# Altium schematic sheet 02-ChargeControl.SchDoc
size A3
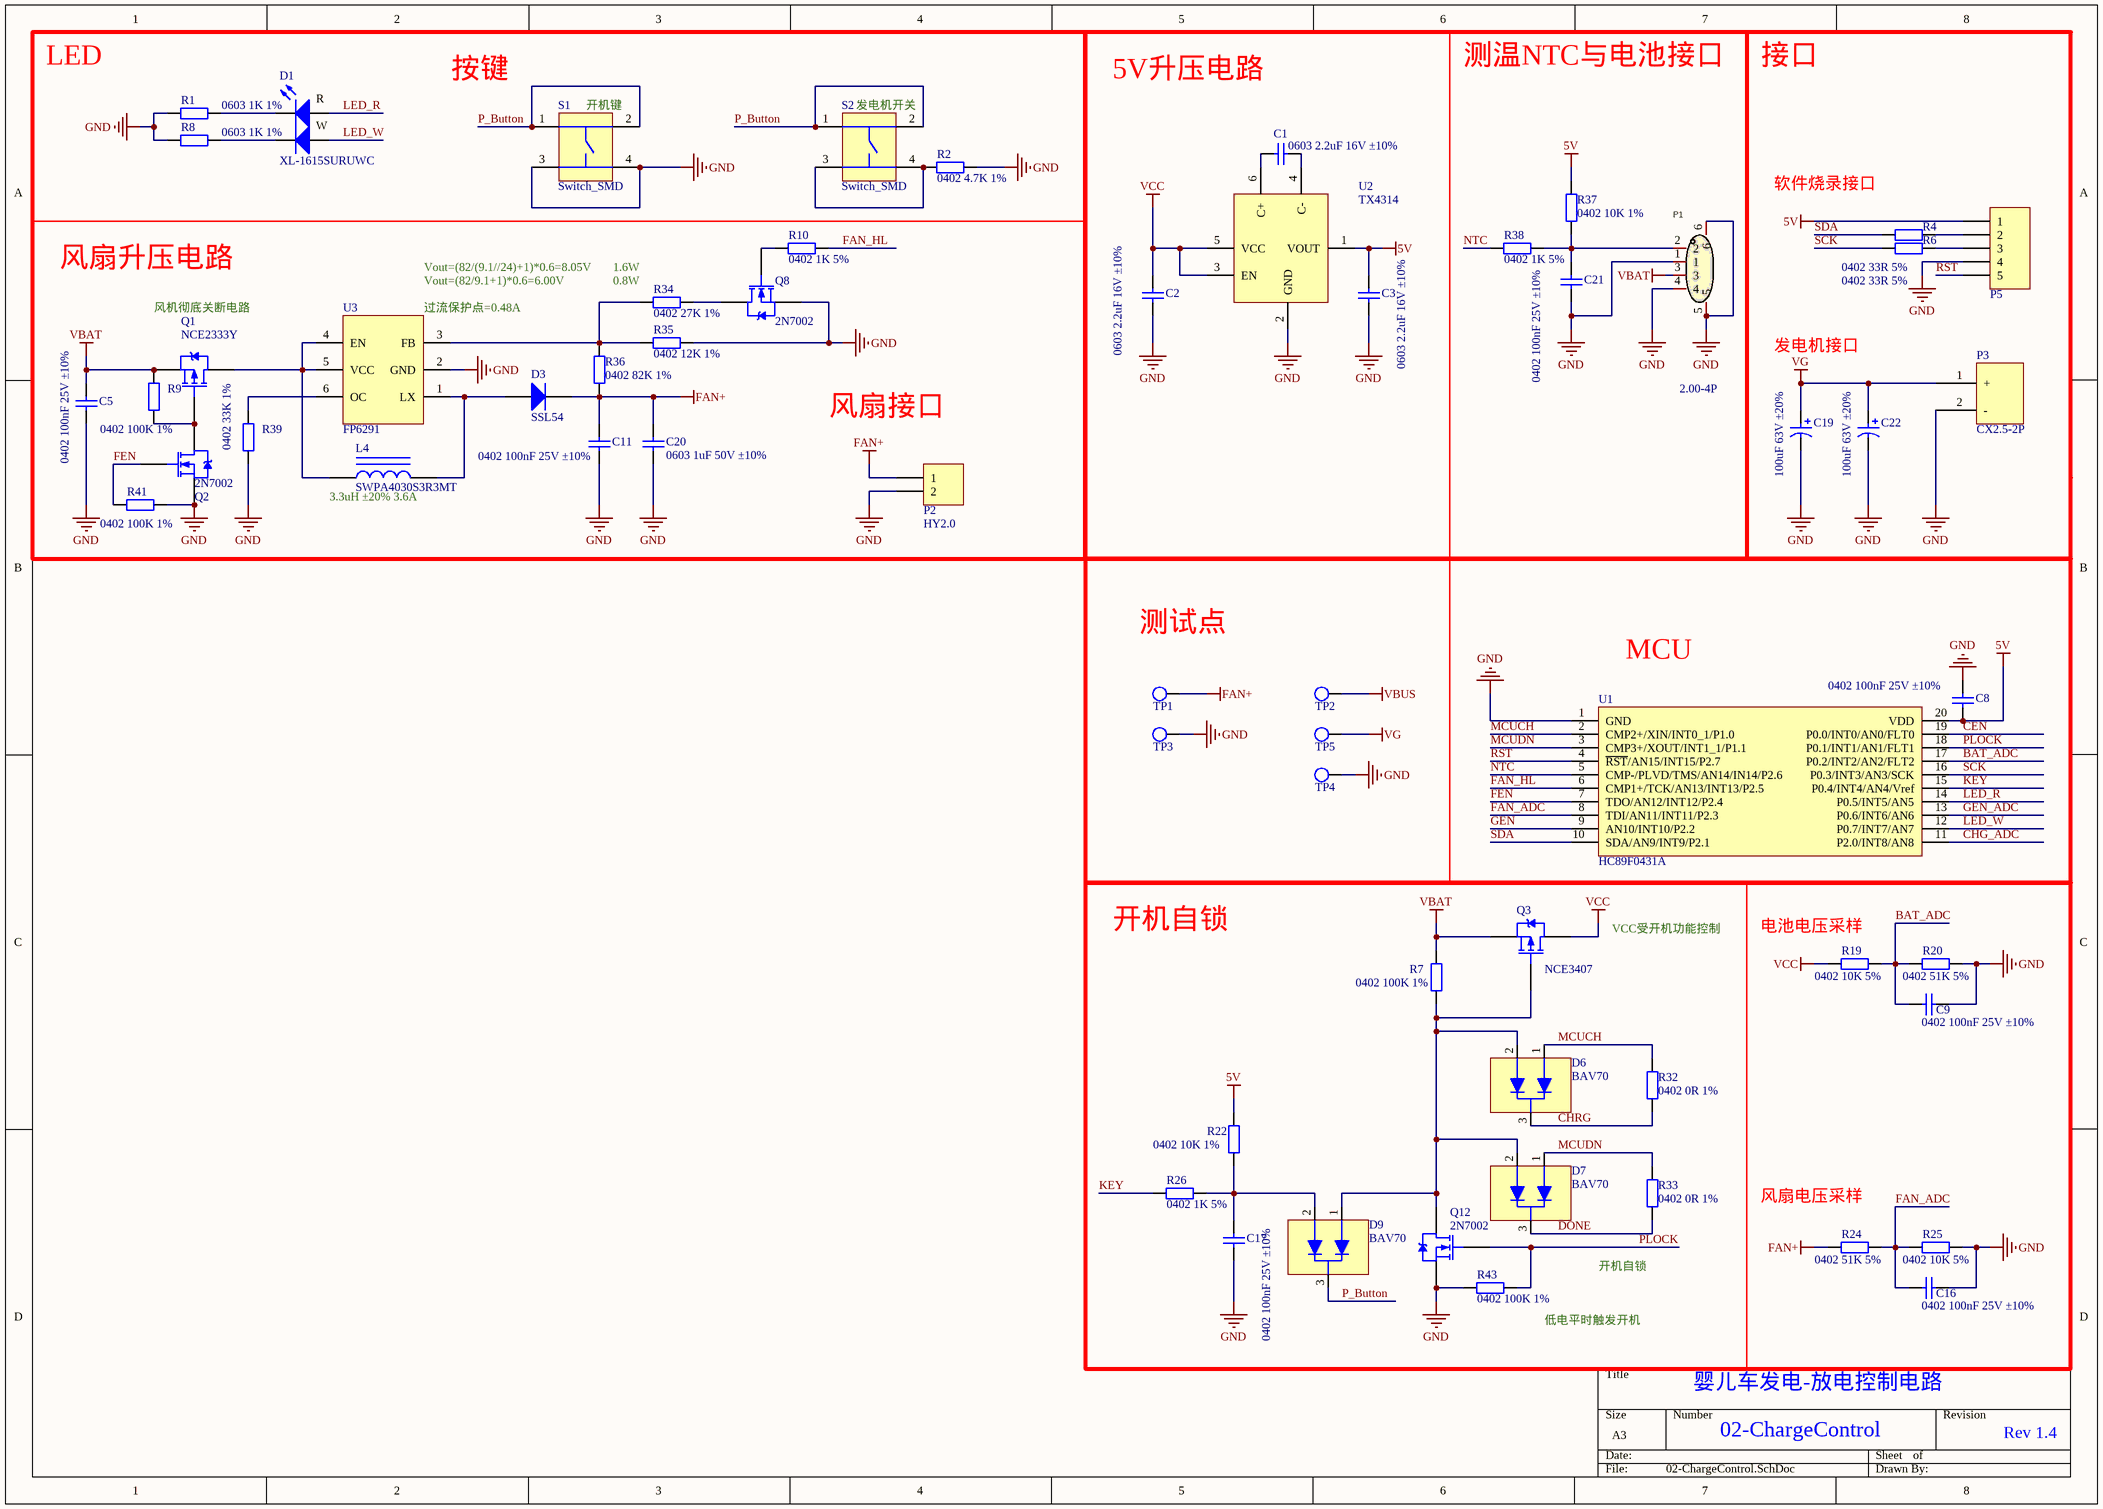
[diagram p0: 02-ChargeControl.SchDoc]

## Parts
C1  0603 2.2uF 16V ±10%  [C0603]
C2  0603 2.2uF 16V ±10%  [C0603]
C3  0603 2.2uF 16V ±10%  [C0603]
C5  0402 100nF 25V ±10%  [C0402]
C8  0402 100nF 25V ±10%  [C0402]
C9  0402 100nF 25V ±10%  [C0402]
C11  0402 100nF 25V ±10%  [C0402]
C16  0402 100nF 25V ±10%  [C0402]
C17  0402 100nF 25V ±10%  [C0402]
C19  100uF 63V ±20%  [CAP-TH_BD8-P3.50-D1.0-WD]
C20  0603 1uF 50V ±10%  [C0603]
C21  0402 100nF 25V ±10%  [C0402]
C22  100uF 63V ±20%  [CAP-TH_BD8-P3.50-D1.0-WD]
D1  XL-1615SURUWC  [LED-SMD_4P-L1.6-W1.5-RD_XL-1615SURUWC]
D3  SSL54  [SMB]
D6  BAV70  [SOT-23-3]
D7  BAV70  [SOT-23-3]
D9  BAV70  [SOT-23-3]
L4  SWPA4030S3R3MT  [IND-SMD_L4.0-W4.0_SMNR4012]
P1  2.00-4P  [CONN-SMD_4P-P2.00]
P2  HY2.0  [CONN-SMD_HY2.0-2P]
P3  CX2.5-2P  [CX2.5-2P]
P5  Header 5  [CONN-TH_5P-2.54-DIR]  (value not drawn)
Q1  NCE2333Y  [SOT-23-3-MOSFET]
Q2  2N7002  [SOT-23-3-MOSFET]
Q3  NCE3407  [SOT-23-3-MOSFET]
Q8  2N7002  [SOT-23-3-MOSFET]
Q12  2N7002  [SOT-23-3-MOSFET]
R1  0603 1K 1%  [R0603]
R2  0402 4.7K 1%  [R0402]
R4  0402 33R 5%  [R0402]
R6  0402 33R 5%  [R0402]
R7  0402 100K 1%  [R0402]
R8  0603 1K 1%  [R0603]
R9  0402 100K 1%  [R0402]
R10  0402 1K 5%  [R0402]
R19  0402 10K 5%  [R0402]
R20  0402 51K 5%  [R0402]
R22  0402 10K 1%  [R0402]
R24  0402 51K 5%  [R0402]
R25  0402 10K 5%  [R0402]
R26  0402 1K 5%  [R0402]
R32  0402 0R 1%  [R0402]
R33  0402 0R 1%  [R0402]
R34  0402 27K 1%  [R0402]
R35  0402 12K 1%  [R0402]
R36  0402 82K 1%  [R0402]
R37  0402 10K 1%  [R0402]
R38  0402 1K 5%  [R0402]
R39  0402 33K 1%  [R0402]
R41  0402 100K 1%  [R0402]
R43  0402 100K 1%  [R0402]
S1  Switch_SMD  [SMD-4_6x6]
S2  Switch_SMD  [SMD-4_6x6]
TP1  TestPoint  [TESTPOINT-70MIL]  (value not drawn)
TP2  TestPoint  [TESTPOINT-70MIL]  (value not drawn)
TP3  TestPoint  [TESTPOINT-70MIL]  (value not drawn)
TP4  TestPoint  [TESTPOINT-70MIL]  (value not drawn)
TP5  TestPoint  [TESTPOINT-70MIL]  (value not drawn)
U1  HC89F0431A  [TSSOP-20]
U2  TX4314  [SOT-23-6]
U3  FP6291  [SOT-23-6]

## Blocks framed on the sheet
开机自锁: C9 C16 C17 D6 D7 D9 Q3 Q12 R7 R19 R20 R22 R24-R26 R32 R33 R43

## Nets
5V: C3.2 C8.1 P5.1 R22.1 R37.2 U1.20(VDD) U2.1(VOUT)
FAN+: C11.2 C20.2 D3.1(K) P2.1 R24.1 R36.1 TP1.1
GND: C2.1 C3.1 C5.1 C8.2 C9.1 C11.1 C16.1 C17.1 C19.2 C20.1 C21.1 C22.2 P1.1 P1.4 P1.5 P1.6 P2.2 P3.2(-) P5.4 Q2.3(S) Q8.3(S) Q12.3(S) R1.2 R2.2 R8.2 R20.2 R25.2 R35.1 R39.2 R41.2 R43.2 S1.3 S1.4 TP3.1 TP4.1 U1.1(GND) U2.2(GND) U3.2(GND)
VBAT: C5.2 P1.3 Q1.3(S) Q3.3(S) R7.1 R9.1
VBUS: TP2.1
VCC: C2.2 Q3.2(D) R19.1 U2.3(EN) U2.5(VCC)
VG: C19.1 C22.1 P3.1(+) TP5.1
BAT_ADC: C9.2 R19.2 R20.1 U1.17(P0.2/INT2/AN2/FLT2)
CEN: U1.19(P0.0/INT0/AN0/FLT0)
CHG_ADC: U1.11(P2.0/INT8/AN8)
CHRG: D6.3(K) R32.1
DONE: D7.3(K) R33.1
FAN_ADC: C16.2 R24.2 R25.1 U1.8(TDI/AN11/INT11/P2.3)
FAN_HL: R10.1 U1.6(CMP1+/TCK/AN13/INT13/P2.5)
FEN: Q2.1(G) R41.1 U1.7(TDO/AN12/INT12/P2.4)
GEN: U1.9(AN10/INT10/P2.2)
GEN_ADC: U1.13(P0.6/INT6/AN6)
KEY: R26.2 U1.15(P0.4/INT4/AN4/Vref)
LED_R: D1.2(+) U1.14(P0.5/INT5/AN5)
LED_W: D1.4(+) U1.12(P0.7/INT7/AN7)
MCUCH: D6.1(A1) R32.2 U1.2(CMP2+/XIN/INT0_1/P1.0)
MCUDN: D7.1(A1) R33.2 U1.3(CMP3+/XOUT/INT1_1/P1.1)
NTC: R38.1 U1.5(CMP-/PLVD/TMS/AN14/IN14/P2.6)
P_Button: D9.3(K) S1.1 S1.2 S2.1 S2.2
PLOCK: Q12.1(G) R43.1 U1.18(P0.1/INT1/AN1/FLT1)
RST: P5.5 U1.4(~{RST}/AN15/INT15/P2.7)
SCK: R6.1 U1.16(P0.3/INT3/AN3/SCK)
SDA: R4.1 U1.10(SDA/AN9/INT9/P2.1)
NetC1_1: C1.1 U2.4(C-)
NetC1_2: C1.2 U2.6(C+)
NetC17_2: C17.2 D9.2(A2) R22.2 R26.1
NetC21_2: C21.2 P1.2 R37.1 R38.2
NetD1_1: D1.1(-) R1.1
NetD1_3: D1.3(-) R8.1
NetD3_2: D3.2(A) L4.2 U3.1(LX)
NetD6_2: D6.2(A2) D7.2(A2) D9.1(A1) Q3.1(G) Q12.2(D) R7.2
NetL4_1: L4.1 Q1.2(D) U3.4(EN) U3.5(VCC)
NetP5_2: P5.2 R4.2
NetP5_3: P5.3 R6.2
NetQ1_1: Q1.1(G) Q2.2(D) R9.2
NetQ8_1: Q8.1(G) R10.2
NetQ8_2: Q8.2(D) R34.1
NetR2_1: R2.1 S2.3 S2.4
NetR34_2: R34.2 R35.2 R36.2 U3.3(FB)
NetR39_1: R39.1 U3.6(OC)

## Notes on the sheet
- LED
- 按键
- (near S1) 开机键
- (near S2) 发电机开关
- 5V升压电路
- 测温NTC与电池接口
- 接口
- 软件烧录接口
- 风扇升压电路
- 风机彻底关断电路
- (near U3) 过流保护点=0.48A
- Vout=(82/(9.1//24)+1)*0.6=8.05V
- Vout=(82/9.1+1)*0.6=6.00V
- (near R34) 1.6W
- (near R34) 0.8W
- 发电机接口
- 风扇接口
- (near L4) 3.3uH ±20% 3.6A
- 测试点
- MCU
- VCC受开机功能控制
- (near R19) 电池电压采样
- (near R24) 风扇电压采样
- (near R43) 低电平时触发开机
- 开机自锁
- 婴儿车发电-放电控制电路
- 02-ChargeControl
- Rev 1.4
- (in symbol XL-1615SURUWC) R; W

## Library data of the parts
C1-C3 C20 = Cap_0603: 贴片电容
C5 C8 C9 C11 C16 C17 C21 = Cap_0402: 贴片电容
C19 C22 = Cap_elec: 电解电容
D1 = XL-1615SURUWC: 0603封装的红白黄色LED
D3 = SS36B: 贴片肖特基二极管
L4 = Inductor Iron: 功率电感
P1 = 2.00-4PWTDK: 连接器4pin，2.00间距; Manufacturer: SHOU HAN(首韩); Name: 1.25-4PWTDK; Add into BOM: yes; Pitch: 1.25mm; Pins Structure: 1x4P; Number of PINs Per Row: 4; Gender: 公型插针; Current Rating (Max): 1A; Symbol: 1.25-4PWTDK; Device: 1.25-4PWTDK; LCSC Part Name: 1.25间距 4P卧贴 带扣; Supplier Part: C3008554; Manufacturer Part: 1.25-4PWTDK; Supplier Footprint: SMD,P=1.25mm; JLCPCB Part Class: Extended Part; Datasheet: https://atta.szlcsc.com/upload/public/pdf/source/20220427/006CB3E3578F619E540A50F8B0C3F638.pdf; Supplier: LCSC; Convert to PCB: yes; Number of Rows: 1; Mounting Style: 卧贴; Operating Temperature Range: -25℃~+85℃
P2 = Header 2: 连接器, 2-Pin
P3 = CX2.5-2P: 磁吸端子 弯插 2pin 2.5针距
P5 = Header 5: 连接器, 5-Pin
Q1 Q3 = NCE2309: P-MOSFET with 3 Pin Vdss=60V Id=1.6A Vgs(th)=2V
Q2 Q8 Q12 = 2N7002: N-MOSFET with 3 Pin Vdss=60V  Id=115mA Vgs(th)=2.5V
R1 R8 = Res_0603: 贴片电阻
R2 R4 R6 R7 R9 R10 R19 R20 R22 R24-R26 R32-R39 R41 R43 = Res_0402: 贴片电阻
S1 S2 = Switch_SMD_4P: 4PIN按键开关
TP1-TP5 = TP: 测试点
U1 = HC89F0431A: 芯圣HC89F0431A
U2 = TX4314: DC-DC升压电荷泵
U3 = FP6291: DC-DC升压控制芯片